# Altium project 1819D_Emetteur_DCF.PrjPcb
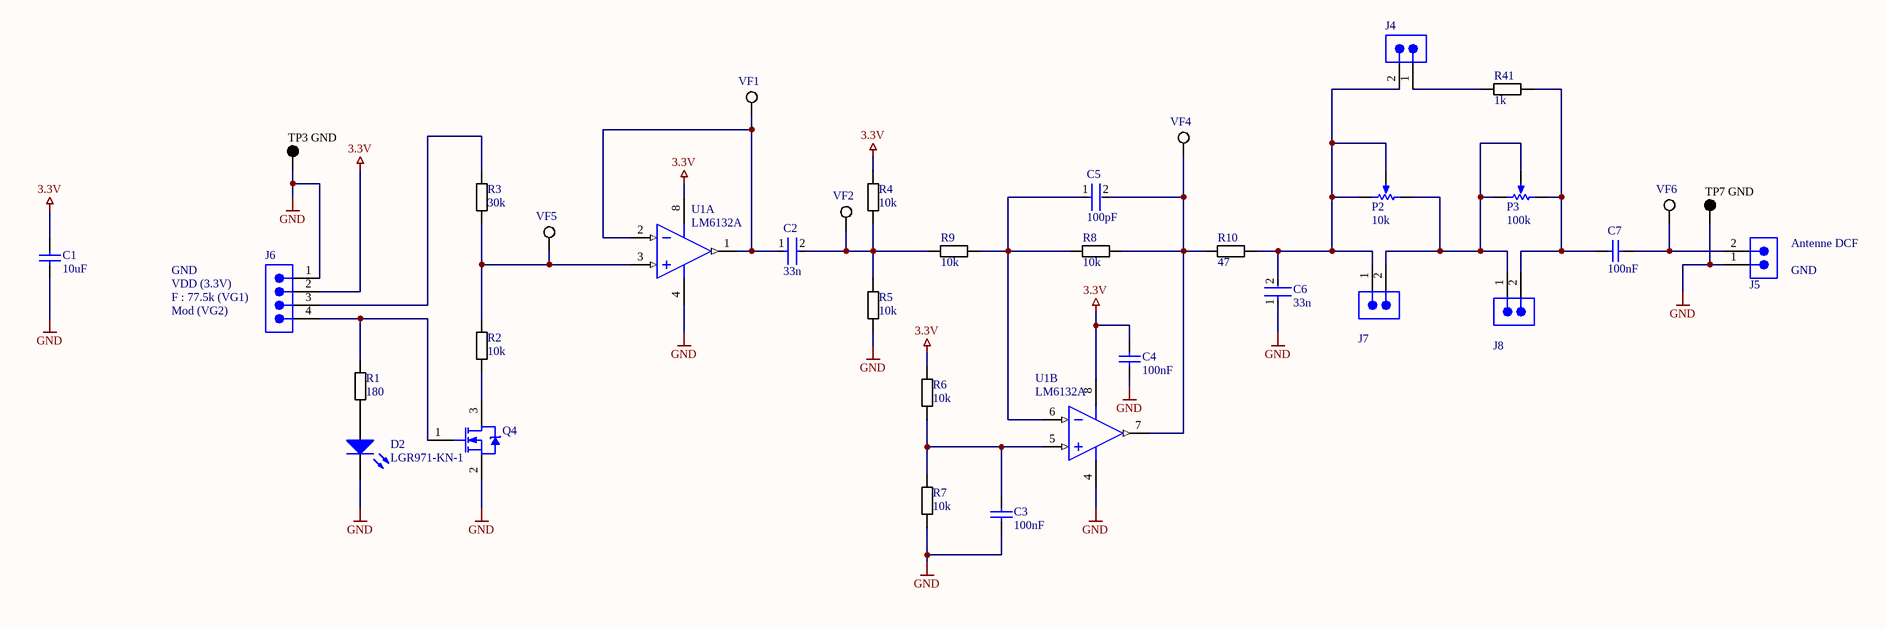
[diagram p0: 1819D_Emetteur_DCF.SchDoc]
1 sheet, 35 parts. Net scope: global (net labels, ports and power ports of the same name join across sheets).
Board file: 1819D_Emetteur_DCF.PcbDoc

## Sheet 1819D_Emetteur_DCF.SchDoc
size A3; Organization: ETML-ES; Address1: Avenue Recordon 1; Address2: 1004 Lausanne; Address3: Switzerland

### Parts
C1  10uF  [CAPC2013X135X45NL10T25]
C2  33n  [FP-C1206C-EB-IPC_B]
C3  100nF  [CAPC2013X140X50LL20T25]
C4  100nF  [CAPC2013X140X50LL20T25]
C5  100pF  [FP-C0805C-DN-MFG]
C6  33n  [FP-C1206C-EB-IPC_B]
C7  100nF  [CAPC2013X140X50LL20T25]
D2  LGR971-KN-1  [LED_0805]
J4  TSW-102-26-L-S  [SMTC-TSW-102-26-XX-S]  (value not drawn)
J5  TSW-102-26-L-S  [SMTC-TSW-102-26-XX-S]  (value not drawn)
J6  TSW-104-08-G-S  [SMTC-TSW-104-08-X-S]  (value not drawn)
J7  TSW-102-26-L-S  [SMTC-TSW-102-26-XX-S]  (value not drawn)
J8  TSW-102-26-L-S  [SMTC-TSW-102-26-XX-S]  (value not drawn)
P2  10k  [BOUR-3362P]
P3  100k  [BOUR-3362P]
Q4  IRLML2402TRPBF  [INTR-IRLML2402TRPBF-3_V]  (value not drawn)
R1  180  [RESC2013X50X30NL20T20]
R2  10k  [RESC2013X50X30NL20T20]
R3  30k  [RESC2013X50X30NL20T20]
R4  10k  [RESC2013X50X30NL20T20]
R5  10k  [RESC2013X50X30NL20T20]
R6  10k  [RESC2013X50X30NL20T20]
R7  10k  [RESC2013X50X30NL20T20]
R8  10k  [RESC2013X50X30NL20T20]
R9  10k  [RESC2013X50X30NL20T20]
R10  47  [RESC2013X50X30NL20T20]
R41  1k  [RESC2013X50X30NL20T20]
TP3_GND  5011  [KSTN-5011_V]  (value not drawn)
TP7_GND  5011  [KSTN-5011_V]  (value not drawn)
U1  LM6132A  [D0008A_N]  (parts A,B of 2)
VF1  5019  [KSTN-5019_V]  (value not drawn)
VF2  5019  [KSTN-5019_V]  (value not drawn)
VF4  5019  [KSTN-5019_V]  (value not drawn)
VF5  5019  [KSTN-5019_V]  (value not drawn)
VF6  5019  [KSTN-5019_V]  (value not drawn)

### Nets
3.3V: C1.2 C4.2 J6.2 R4.1 R6.2 U1.8(V+)
GND: C1.1 C3.1 C4.1 C6.1 D2.1(K) J5.1 J6.1 Q4.2(S) R5.2 R7.1 TP3_GND.1 TP7_GND.1 U1.4(V-)
NetC2_1: C2.1 U1.1(OUTA) U1.2(INA-) VF1.1
NetC2_2: C2.2 R4.2 R5.1 R9.1 VF2.1
NetC3_2: C3.2 R6.1 R7.2 U1.5(INB+)
NetC5_1: C5.1 R8.1 R9.2 U1.6(INB-)
NetC5_2: C5.2 R8.2 R10.1 U1.7(OUTB) VF4.1
NetC6_2: C6.2 J4.2 J7.1 P2.2(S) P2.3(CW) R10.2
NetC7_1: C7.1 J5.2 VF6.1
NetC7_2: C7.2 J8.2 P3.1(CCW) R41.2
NetD2_2: D2.2(A) R1.2
NetJ4_1: J4.1 R41.1
NetJ6_3: J6.3 R3.1
NetJ6_4: J6.4 Q4.1(G) R1.1
NetJ7_2: J7.2 J8.1 P2.1(CCW) P3.2(S) P3.3(CW)
NetQ4_3: Q4.3(D) R2.2
NetR2_1: R2.1 R3.2 U1.3(INA+) VF5.1

### Notes on the sheet
- GND
- (near J5) GND
- (near J5) Antenne DCF
- VDD (3.3V)
- (near J6) F : 77.5k (VG1)
- Mod (VG2)
- Fichier :
- a
- Date :
- Heure :
- Version :
- Auteur :
- Modif.
- b
- c
- d
- Projet :
- No :
- Nb feuilles
- Feuille n°
- Chemin :

### Library data of the parts
C1 = CMP-2007-03514-1: Manufacturer: Murata; Part Number: GRM21BF51C106ZE15L
C2 C6 = CMP-03020-013789-1: Multilayer Ceramic Capacitor, C Series, 0.033 - F, - 10%, X7r, 50 V, 1206 [3216 Metric]; Manufacturer: KEMET; Manufacturer Part Number: C1206C333K5RACTU; Capacitance: 33,000 pF; Tolerance: 0.1; Temperature Coefficient: 15%; Automotive Grade: Grade 0; Voltage Rating: 50 V; Value: 33,000 pF; Temperature Range Low: -55°C; ComponentLink2Description: Datasheet; Device Class L3: Ceramic Capacitors; Category: Cap; Digikey Description: Multilayer Ceramic Capacitor, C Series, 0.033 - F, - 10%, X7r, 50 V, 1206 [3216 Metric]; Device Class L2: Capacitors; Ipc Land Pattern Name: CAPC320160X78; Temperature Characteristic: X7R; Mouser Description: Multilayer Ceramic Capacitor, C Series, 0.033 - F, - 10%, X7r, 50 V, 1206 [3216 Metric]; Octopart: https://octopart.com/c1206c333k5ractu-kemet-125953; Temperature Range High: +150°C; Temperature: -55°C to +150°C; RoHS: TRUE; Package: C1206C-EB; ComponentLink2URL: https://content.kemet.com/datasheets/KEM_C1007_X8R_ULTRA_150C_SMD.pdf; Automotive: Yes; Material: Ceramic; Height: 0.88mm; Lead Free: Yes; Device Class L1: Passive Components
C3 C4 C7 = CMP-2007-04556-1: Part Number: 08051A470JAT2A; Manufacturer: AVX Interconnect / Elco
C5 = CMP-03020-013647-1: CAP CER 100PF 50V C0G/NP0 0805; Manufacturer Part Number: C0805C101J5GACTU; Manufacturer: KEMET; Temperature Characteristic: C0G; Tolerance: 0.05; Material: Ceramic; Temperature Coefficient: 30ppm/°C; Temperature Range High: +125°C; Voltage Rating: 50 V; Device Class L1: Passive Components; Category: Cap; Capacitance: 100 pF; Temperature Range Low: -55°C; Height: 0.88mm; Package: C0805C-DN; Device Class L2: Capacitors; Octopart: https://octopart.com/c0805c101j5gactu-kemet-100795; Ipc Land Pattern Name: CAPC200125X78; Value: 100 pF; RoHS: TRUE; Temperature: -55°C to +125°C; Lead Free: Yes; Automotive: No; ComponentLink2URL: https://content.kemet.com/datasheets/KEM_C1003_C0G_SMD.pdf; ComponentLink2Description: Datasheet; Digikey Description: CAP CER 100PF 50V C0G/NP0 0805; Device Class L3: Ceramic Capacitors
D2 = LGR971-KN-1: SMD mono-color Chip LED, 0805, Green; Manufacturer: Wuerth Elektronik; PackageReference: 0805_A; Color: Green; PartNumber: LGR971-KN-1; ComponentLink1Description: Manufacturer URL; ComponentLink2Description: Datasheet; Supplier: Stock ES; Value: LGR971-KN-1
J4 J5 J7 J8 = CMP-1024-00330-1: 0.025" SQ Post Header, Through-hole, Vertical, -55 to 125 degC, 2.54 mm Pitch, 2-Pin, Male, RoHS; Manufacturer: Samtec; Pitch: 2.54 mm; DatasheetVersion: F-214; PackageReference: TSW-102-26-XX-S; ComponentLink3Description: Package Specification; PackageDescription: .025[0.64] SQ. Post Terminal Strip Assembly; PackageVersion: DM, 8/1988; ComponentLink1Description: Manufacturer URL; ComponentLink2URL: http://www.samtec.com/documents/webfiles/pdf/TSW_TH.PDF; ComponentLink3URL: http://www.samtec.com/documents/webfiles/cpdf/TSW-XXX-XX-XXX-X-XX-XXX-MKT.pdf; ComponentLink2Description: Datasheet; Temperature Range: -55 to 125 degC; Mounting Technology: Through-hole; ComponentLink1URL: http://www.samtec.com; RoHS: True; PartNumber: TSW-102-26-L-S; Orientation: Vertical
J6 = CMP-1024-00357-1: 0.025" SQ Post Header, Through-hole, Vertical, -55 to 125 degC, 2.54 mm Pitch, 4-Pin, Male, RoHS; Manufacturer: Samtec; Pitch: 2.54 mm; RoHS: True; ComponentLink3URL: http://www.samtec.com/documents/webfiles/cpdf/TSW-XXX-XX-XXX-X-XX-XXX-MKT.pdf; Mounting Technology: Through-hole; ComponentLink2URL: http://www.samtec.com/documents/webfiles/pdf/TSW_TH.PDF; ComponentLink1URL: http://www.samtec.com; ComponentLink3Description: Package Specification; PackageVersion: DM, 8/1988; ComponentLink2Description: Datasheet; PackageReference: TSW-104-08-X-S; PackageDescription: .025[0.64] SQ. Post Terminal Strip Assembly; PartNumber: TSW-104-08-G-S; ComponentLink1Description: Manufacturer URL; Temperature Range: -55 to 125 degC; DatasheetVersion: F-214; Orientation: Vertical
P2 = CMP-1747-00004-1: Square Trimpot(R) Trimming Potentiometer, 10 KOhm, 300 V, -55 to 125 degC, 3-Pin THD, RoHS, Tube; Voltage Rating: 220 mV; Power Rating: 1 W; Tolerance: 1%; Resistance: 50 mohm; Case/Package: 1206; Length: 3.2 mm; RoHSCompliant: True; PackageDescription: 3-Pin Through Hole Device, Body 6.6 x 6.99 mm, Pitch 2.54 mm; ComponentLink2Description: Datasheet; REACH SVHC: No SVHC; Mount: Surface Mount; Height: 0.6 mm; Packaging: Tape and Reel; ComponentLink1URL: http://www.bourns.com/; Case Code (Imperial): 0612; Pins: 2; Case Code (Metric): 1632; ComponentLink2URL: http://www.bourns.com/docs/Product-Datasheets/3362.pdf; Min Operating Temperature: -25degC; ComponentLink1Description: Manufacturer URL; PackageReference: 3326P; Max Operating Temperature: 125degC; Width: 1.6 mm; Package Quantity: 5000; DatasheetVersion: May-16
P3 = CMP-1747-00003-1: Square Trimpot(R) Trimming Potentiometer, 100 KOhm, 300 V, -55 to 125 degC, 3-Pin THD, RoHS, Tube; Voltage Rating: 250 V; Case\Package: Axial; Tolerance: 1%; Power Rating: 250 mW; Resistance: 1 mohm; RoHSCompliant: true; ComponentLink2URL: http://www.bourns.com/docs/Product-Datasheets/3362.pdf; ComponentLink1Description: Manufacturer URL; DatasheetVersion: May-16; Package Quantity: 200; ComponentLink2Description: Datasheet; Min Operating Temperature: -55 degC; Mount: Through Hole; PackageDescription: 3-Pin Through Hole Device, Body 6.6 x 6.99 mm, Pitch 2.54 mm; Length: 0.248 inch; ComponentLink1URL: http://www.bourns.com/; PackageReference: 3326P; Max Operating Temperature: 155 degC; Packaging: Bulk
Q4 = CMP-2000-05155-1: HEXFET(R) Power MOSFET, N-Channel, 20 V, 1.2 A, 3-Pin SOT-23, RoHS, Tape and Reel; Manufacturer: International Rectifier; Voltage Vgs Rds on Measurement: 4.5V; Current Id Max: 1.2A; External Width: 3.05mm; Transistor Polarity: NChannel; No. of Pins: 3; Power Dissipation Pd: 540mW; External Length / Height: 1.12mm; Full Power Rating Temperature: 25degC; On Resistance Rds(on): 250mohm; Voltage Vds Typ: 20V; SMD Marking: 1A; No. of Transistors: 1; Reel Quantity: 3000; External Depth: 2.5mm; Pulse Current Idm: 7.4A; Junction Temperature Tj Min: -55degC; Threshold Voltage Vgs Typ: 700mV; SVHC: NoSVHC(19-Dec-2012); Datasheet URL: https://datasheet.ciiva.com/29326/162826-da-01-en-irlml-2402tr-29326791.pdf; Tape Width: 8mm; Operating Temperature Range: -55degCto+150degC; Manufacturer URL: http://internationalrectifier.com/; Termination Type: SMD; Datasheet Version: Jan-03; Current Temperature: 25degC; Package / Case: SOT-23; Drain Source Voltage Vds: 20V; Rds(on) Test Voltage Vgs: 4.5V; Continuous Drain Current Id: 1.2A; Transistor Case Style: SOT-23; Voltage Vgs th Min: 700mV; Voltage Vgs Max: 700mV
R1-R10 R41 = Resistance
TP3_GND TP7_GND = CMP-1672-00003-4: Test Point, Black, Through Hole, RoHS, Bulk; Manufacturer: Keystone; ComponentLink2URL: http://www.keyelco.com/product-pdf.cfm?p=1320; Colour: Black; Pins: 1; REACH SVHC: No SVHC; ComponentLink1URL: http://www.keyelco.com/; PackageReference: 5011; Contact Plating: Silver; Package Quantity: 100; Packaging: Bulk; RoHSCompliant: true; Height: 8.12 mm; PackageDescription: 1-Pin Through Hole Device, Dia 3.17 mm; Mount: Through Hole; Mounting Technology: Through Hole; DatasheetVersion: Rev. F, 12/2013; ComponentLink1Description: Manufacturer URL; Contact Material: Bronze; ComponentLink2Description: Datasheet
U1 = CMP-0055-00786-3: Dual Low Power 10 MHz Rail-to-Rail I/O Operational Amplifier, 8-pin Narrow SOIC, Pb-Free; Manufacturer: Texas Instruments; CompType: Amplifiers; PackageTopMarking: NSZXTT*LM61*32AIM; PowerWise: N; ComponentLink1URL: http://www.ti.com/general/docs/lit/getliterature.tsp?genericPartNumber=LM6132&fileType=pdf; ComponentLink1Description: Datasheet URL; Package Reference: D0008A; Code_JEDEC: MS-012-AA; PinCount: 8; RoHS: Y; PackageDescription: SOIC Narrow, 4.9 x 3.9 x 1.45mm, 8 Lead, 1.27mm Pitch; Code_IPC: SOIC127P600-8
VF1 VF2 VF4-VF6 = CMP-1672-00008-1: Test Point, 1 Position SMD, RoHS, Tape and Reel; ComponentLink1Description: Manufacturer URL; Package Quantity: 1000; DatasheetVersion: 03/2014; Packaging: Tape and Reel; ComponentLink2URL: http://www.keyelco.com/product-pdf.cfm?p=1357; ComponentLink1URL: http://www.keyelco.com/; Mount: Surface Mount; Contact Plating: Silver; PackageDescription: 1-Pin Surface Mount Device, Body 3.81 x 2.03 mm; Pins: 1; RoHSCompliant: True; Mounting Technology: Surface Mount; ComponentLink2Description: Datasheet; PackageReference: 5019